# Altium schematic sheet LEDS AND DRIVER.SchDoc
size A4
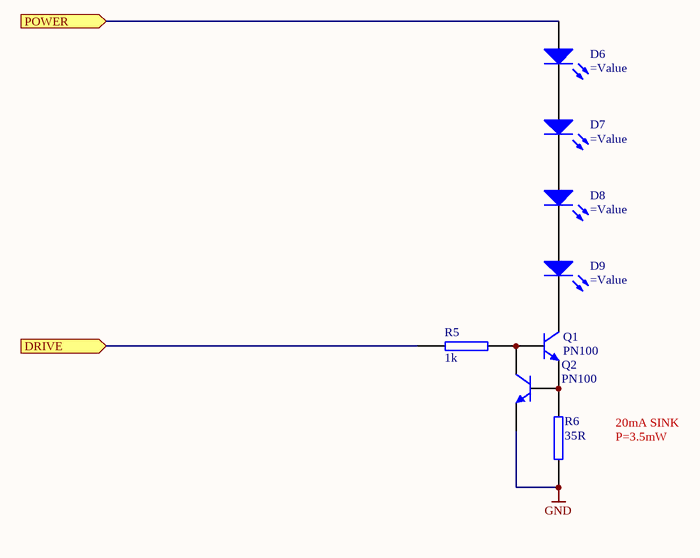
[diagram p0: LEDS AND DRIVER.SchDoc]

## Parts
D6  (no value)  [LED(3D) 5MM VERTICAL (YELLOW)]
D7  (no value)  [LED(3D) 5MM VERTICAL (YELLOW)]
D8  (no value)  [LED(3D) 5MM VERTICAL (YELLOW)]
D9  (no value)  [LED(3D) 5MM VERTICAL (YELLOW)]
Q1  PN100  [TO-92]
Q2  PN100  [TO-92]
R5  1k  [AXIAL-0.4]
R6  35R  [AXIAL-0.4]

## Ports
DRIVE (in), POWER (in)

## Nets
GND: Q2.1(E) R6.1
DRIVE: R5.2 ; port DRIVE
POWER: D6.1(A) ; port POWER
NetD6_2: D6.2(K) D7.1(A)
NetD7_2: D7.2(K) D8.1(A)
NetD8_2: D8.2(K) D9.1(A)
NetD9_2: D9.2(K) Q1.3(C)
NetQ1_1: Q1.1(E) Q2.2(B) R6.2
NetQ1_2: Q1.2(B) Q2.3(C) R5.1

## Notes on the sheet
- 20mA SINK
- P=3.5mW

## Library data of the parts
D6-D9 = LED 3mm RED: LED 55
Q1 Q2 = PN100: NPN Bipolar Transistor; Revision: July-2002: Re-released for DXP Platform.; value: PN100
R5 R6 = RES SMD 0603 1k: RESISTOR SMD 0603 1k
  R5: value: 1k
  R6: value: 35R